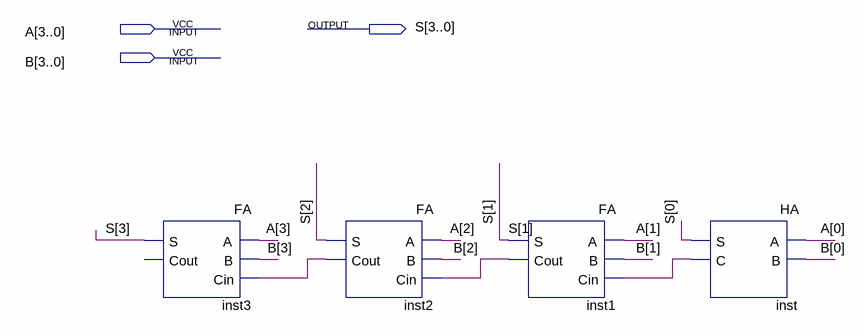
[diagram p0: schematic sheet]
// Quartus schematic RCA.bdf as structural Verilog: 4 symbols, 3 pins
module RCA (
  input  [3:0] A,
  input  [3:0] B,
  output [3:0] S
);

  wire inst1_cout, inst2_cout, inst_c;

  FA inst3 (.A(A[3]), .B(B[3]), .Cin(inst2_cout), .S(S[3]));  // open: Cout
  FA inst2 (.A(A[2]), .B(B[2]), .Cin(inst1_cout), .S(S[2]), .Cout(inst2_cout));
  FA inst1 (.A(A[1]), .B(B[1]), .Cin(inst_c), .S(S[1]), .Cout(inst1_cout));
  HA inst (.A(A[0]), .B(B[0]), .S(S[0]), .C(inst_c));
endmodule
